# EAGLE schematic esquematico2 (EAGLE 9.2.0)
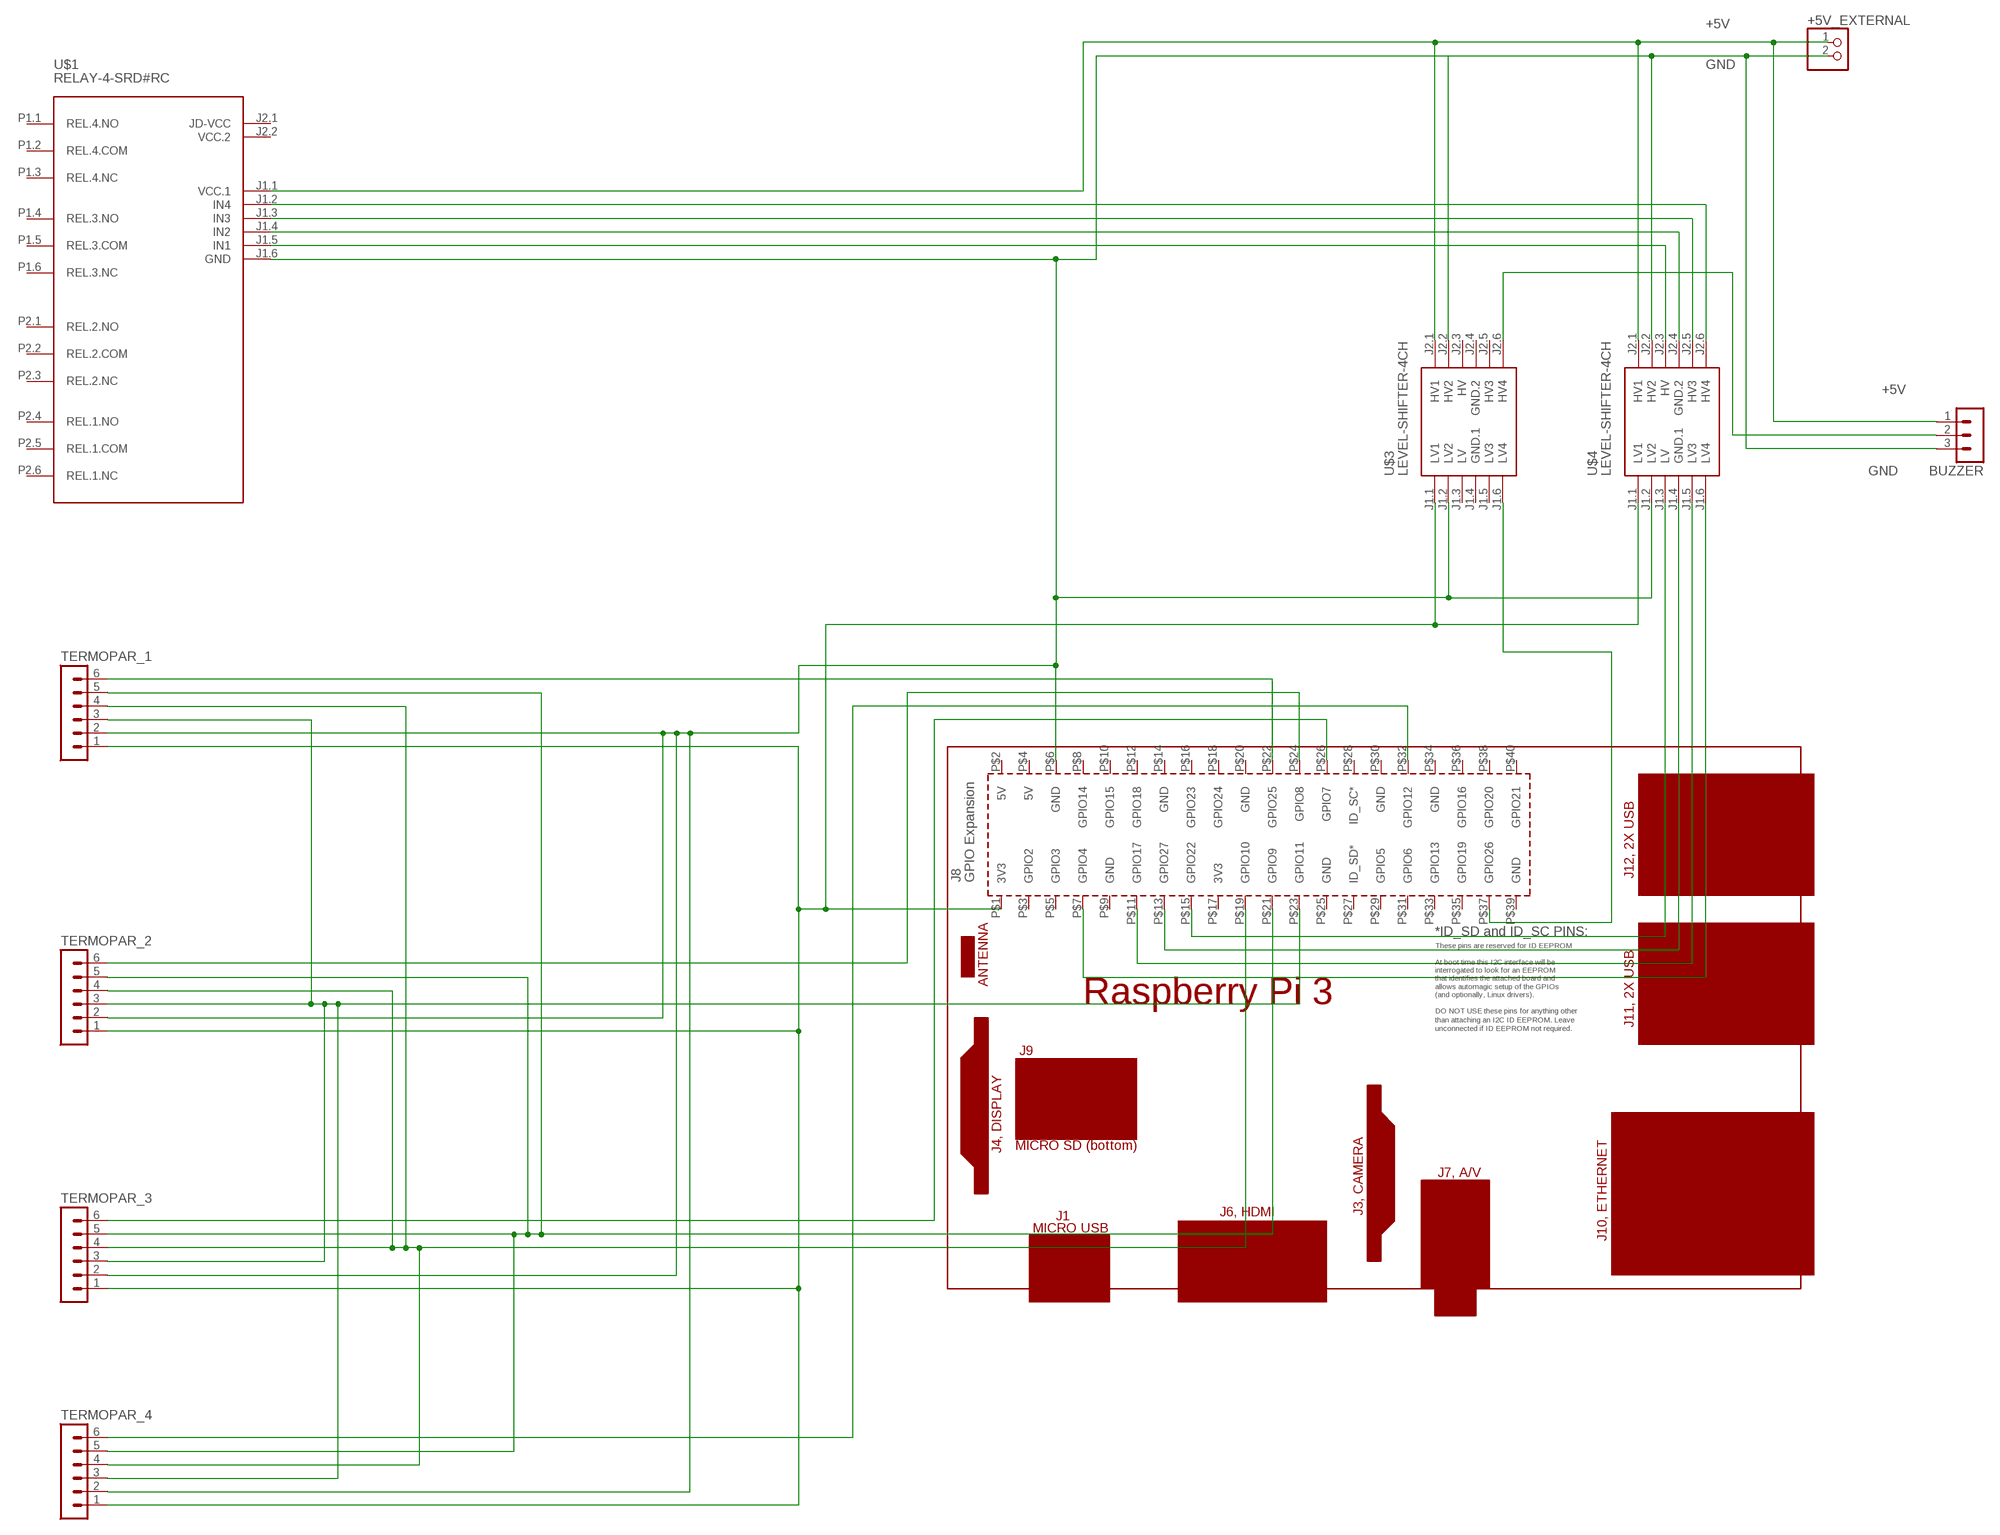
[diagram p0: schematic, sheet 1]

## Parts
+5V_EXTERNAL  PINHD-1X2  [1X02]
BUZZER  MA03-1  [MA03-1]
PCB1  RPI3RPI3  [RPI3]
TERMOPAR_1  MA06-1  [MA06-1]
TERMOPAR_2  MA06-1  [MA06-1]
TERMOPAR_3  MA06-1  [MA06-1]
TERMOPAR_4  MA06-1  [MA06-1]
U$1  RELAY-4-SRD#RC  [RELAY-4-SRD#RC]
U$3  LEVEL-SHIFTER-4CH  [LEVEL-SHIFTER-4CH]
U$4  LEVEL-SHIFTER-4CH  [LEVEL-SHIFTER-4CH]

## Nets
+5V: +5V_EXTERNAL.1 BUZZER.1 U$1.J1.1(VCC.1) U$3.J2.1(HV1) U$4.J2.1(HV1)
GND: +5V_EXTERNAL.2 BUZZER.3 PCB1.P$6(GND) TERMOPAR_1.2 TERMOPAR_2.2 TERMOPAR_3.2 TERMOPAR_4.2 U$1.J1.6(GND) U$3.J1.2(LV2) U$3.J2.2(HV2) U$4.J1.2(LV2) U$4.J2.2(HV2)
N$1: U$1.J1.2(IN4) U$4.J2.6(HV4)
N$2: U$1.J1.3(IN3) U$4.J2.5(HV3)
N$3: U$1.J1.4(IN2) U$4.J2.4(GND.2)
N$4: U$1.J1.5(IN1) U$4.J2.3(HV)
N$5: PCB1.P$15(GPIO22) U$4.J1.3(LV)
N$6: PCB1.P$13(GPIO27) U$4.J1.4(GND.1)
N$7: PCB1.P$11(GPIO17) U$4.J1.5(LV3)
N$8: PCB1.P$7(GPIO4) U$4.J1.6(LV4)
N$9: PCB1.P$37(GPIO26) U$3.J1.6(LV4)
N$10: BUZZER.2 U$3.J2.6(HV4)
N$14: PCB1.P$1(3V3) TERMOPAR_1.1 TERMOPAR_2.1 TERMOPAR_3.1 TERMOPAR_4.1 U$3.J1.1(LV1) U$4.J1.1(LV1)
N$16: PCB1.P$23(GPIO11) TERMOPAR_1.3 TERMOPAR_2.3 TERMOPAR_3.3 TERMOPAR_4.3
N$17: PCB1.P$19(GPIO10) TERMOPAR_1.4 TERMOPAR_2.4 TERMOPAR_3.4 TERMOPAR_4.4
N$18: PCB1.P$21(GPIO9) TERMOPAR_1.5 TERMOPAR_2.5 TERMOPAR_3.5 TERMOPAR_4.5
N$19: PCB1.P$22(GPIO25) TERMOPAR_1.6
N$20: PCB1.P$24(GPIO8) TERMOPAR_2.6
N$21: PCB1.P$26(GPIO7) TERMOPAR_3.6
N$22: PCB1.P$32(GPIO12) TERMOPAR_4.6
Unconnected: PCB1.P$2(5V) PCB1.P$3(GPIO2) PCB1.P$4(5V) PCB1.P$5(GPIO3) PCB1.P$8(GPIO14) PCB1.P$9(GND) PCB1.P$10(GPIO15) PCB1.P$12(GPIO18) PCB1.P$14(GND) PCB1.P$16(GPIO23) PCB1.P$17(3V3) PCB1.P$18(GPIO24) PCB1.P$20(GND) PCB1.P$25(GND) PCB1.P$27(ID_SD*) PCB1.P$28(ID_SC*) PCB1.P$29(GPIO5) PCB1.P$30(GND) PCB1.P$31(GPIO6) PCB1.P$33(GPIO13) PCB1.P$34(GND) PCB1.P$35(GPIO19) PCB1.P$36(GPIO16) PCB1.P$38(GPIO20) PCB1.P$39(GND) PCB1.P$40(GPIO21) U$1.J2.1(JD-VCC) U$1.P1.1(REL.4.NO) U$1.P1.2(REL.4.COM) U$1.P1.3(REL.4.NC) U$1.P1.4(REL.3.NO) U$1.P1.5(REL.3.COM) U$1.P1.6(REL.3.NC) U$1.P2.1(REL.2.NO) U$1.P2.2(REL.2.COM) U$1.P2.3(REL.2.NC) U$1.P2.4(REL.1.NO) U$1.P2.5(REL.1.COM) U$1.P2.6(REL.1.NC) U$3.J1.5(LV3) U$3.J2.5(HV3)

## Power pins joined to a net without a drawn wire
GND.1: U$3.J1.4(GND.1)
GND.2: U$3.J2.4(GND.2)
HV: U$3.J2.3(HV)
LV: U$3.J1.3(LV)
VCC.2: U$1.J2.2(VCC.2)

## Library data of the parts
+5V_EXTERNAL = pinhead:PINHD-1X2: PIN HEADER
BUZZER = con-lstb:MA03-1: PIN HEADER; OC_FARNELL: unknown; OC_NEWARK: unknown
PCB1 = e14_Rpi3_RevA+mirror-pcb:RPI3: Device for Raspberry Pi 3 board created by Dave Young for www.element14.com More information and support community is available at https://www.element14.com/community/community/raspberry-pi Device for Raspberry Pi 3 board updated by Gerald Schwarz for www.element14.com On RPI3 addet the layer milling and created a mirrored shield.
TERMOPAR_1-TERMOPAR_4 = con-lstb:MA06-1: PIN HEADER; OC_FARNELL: unknown; OC_NEWARK: unknown
U$1 = diy-modules:RELAY-4-SRD#RC: 4-Channel Relay Module based on SRD-05VDC-SL-C relays Symbol with relays pins Click here to find device on ebay.com <http://www.ebay.com/sch/four+channel+relay+module+optocoupler+5v>
U$3 U$4 = diy-modules_modified:LEVEL-SHIFTER-4CH: 4-Channel Bi-Directional Logic Level Converter based on BSS128 transistors Click here to find device on ebay.com <http://www.ebay.com/sch/i2c+logic+converter+module>